# Altium schematic sheet Due_Breakout_Board supporting circuits.SchDoc: Due Breakout Board Supporting Circuits
size A; Author: A. Jefferson; Engineer: A. Jefferson; DocumentNumber: 3; Revision: A; SheetNumber: 3; SheetTotal: 3
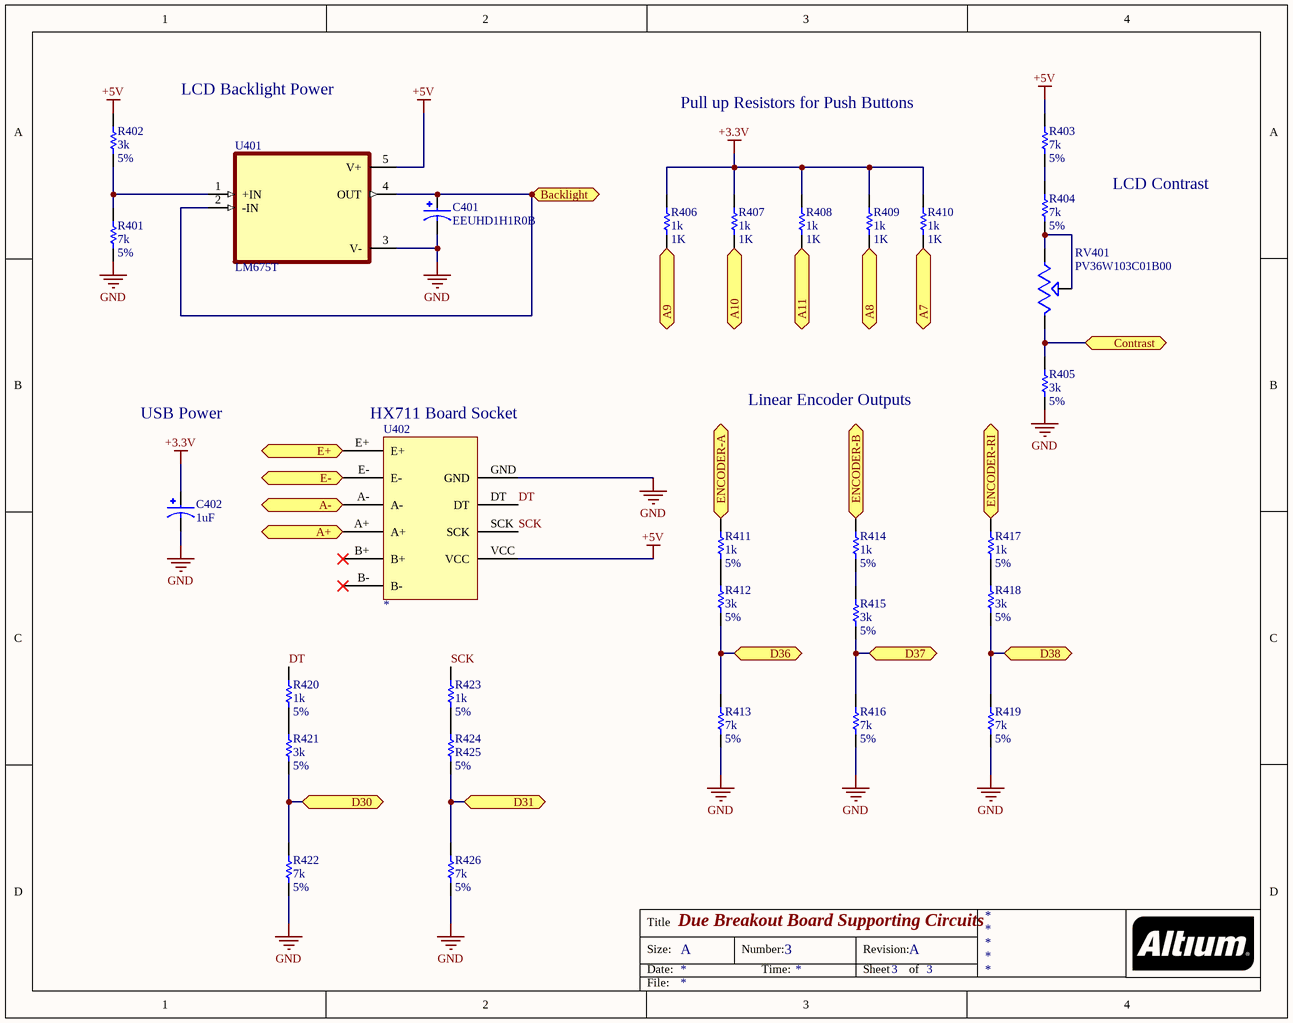
[diagram p0: Due_Breakout_Board supporting circuits.SchDoc]

## Parts
C401  EEUHD1H1R0B  [CAPPRD500W50D500H1100]
C402  1uF  [CAPPRD500W50D500H1100]
R401  7k  value 5%  [AXIAL-0.3]
R402  3k  value 5%  [AXIAL-0.3]
R403  7k  value 5%  [AXIAL-0.3]
R404  7k  value 5%  [AXIAL-0.3]
R405  3k  value 5%  [AXIAL-0.3]
R406  1k  [AXIAL-0.3]
R407  1k  [AXIAL-0.3]
R408  1k  [AXIAL-0.3]
R409  1k  [AXIAL-0.3]
R410  1k  [AXIAL-0.3]
R411  1k  value 5%  [AXIAL-0.3]
R412  3k  value 5%  [AXIAL-0.3]
R413  7k  value 5%  [AXIAL-0.3]
R414  1k  value 5%  [AXIAL-0.3]
R415  3k  value 5%  [AXIAL-0.3]
R416  7k  value 5%  [AXIAL-0.3]
R417  1k  value 5%  [AXIAL-0.3]
R418  3k  value 5%  [AXIAL-0.3]
R419  7k  value 5%  [AXIAL-0.3]
R420  1k  value 5%  [AXIAL-0.3]
R421  3k  value 5%  [AXIAL-0.3]
R422  7k  value 5%  [AXIAL-0.3]
R423  1k  value 5%  [AXIAL-0.3]
R424  R425  value 5%  [AXIAL-0.3]
R426  7k  value 5%  [AXIAL-0.3]
RV401  PV36W103C01B00  [TRIM_PV36W103C01B00]
U401  LM675T  [TO170P1016X470X2092-5]
U402  *  [HX711_MOD]

## Ports
A7, A8, A9, A10, A11, A+, A-, Backlight, Contrast, D30, D31, D36, D37, D38, E+, E-, ENCODER-A, ENCODER-B, ENCODER-RI

## Nets
+3.3V: C402.P R406.2 R407.2 R408.2 R409.1 R410.1
+5V: R402.2 R403.2 U401.5(V+) U402.VCC
GND: C401.N C402.N R401.1 R405.1 R413.1 R416.1 R419.1 R422.1 R426.1 U401.3(V-) U402.GND
A7: R410.2 ; port A7
A8: R409.2 ; port A8
A9: R406.1 ; port A9
A10: R407.1 ; port A10
A11: R408.1 ; port A11
A+: U402.A+ ; port A+
A-: U402.A- ; port A-
Backlight: C401.P U401.2(-IN) U401.4(OUT) ; port Backlight
Contrast: R405.2 RV401.3 ; port Contrast
D30: R421.1 R422.2 ; port D30
D31: R424.1 R426.2 ; port D31
D36: R412.1 R413.2 ; port D36
D37: R415.1 R416.2 ; port D37
D38: R418.1 R419.2 ; port D38
DT: R420.2 U402.DT
E+: U402.E+ ; port E+
E-: U402.E- ; port E-
ENCODER-A: R411.2 ; port ENCODER-A
ENCODER-B: R414.2 ; port ENCODER-B
ENCODER-RI: R417.2 ; port ENCODER-RI
SCK: R423.2 U402.SCK
NetR401_2: R401.2 R402.1 U401.1(+IN)
NetR403_1: R403.1 R404.2
NetR404_1: R404.1 RV401.1 RV401.2
NetR411_1: R411.1 R412.2
NetR414_1: R414.1 R415.2
NetR417_1: R417.1 R418.2
NetR420_1: R420.1 R421.2
NetR423_1: R423.1 R424.2

Not connected (* = marked no-connect by the designer): U402 B+* B-*

## Notes on the sheet
- LCD Backlight Power
- Pull up Resistors for Push Buttons
- LCD Contrast
- USB Power
- (near U402) HX711 Board Socket
- Linear Encoder Outputs
- Title
- Size:
- Date:
- A
- Number:
- Time:
- Revision:
- Sheet
- of
- File:

## Library data of the parts
C401 C402 = EEUHD1H1R0B: Cap Aluminum Lytic 1uF 50V 20% (5 X 11mm) Radial 5mm 10mA 1000h 105Â°C Automotive Ammo; MF: Panasonic; Package: RADIAL-2 Panasonic; Price: None; Check_prices: https://www.snapeda.com/parts/EEUHD1H1R0B/Panasonic/view-part/5786221/?ref=eda; Value: *; MP: EEUHD1H1R0B; SnapEDA_Link: https://www.snapeda.com/parts/EEUHD1H1R0B/Panasonic/view-part/5786221/?ref=snap; Availability: In Stock
R401-R424 R426 = Res1: Resistor; Published: 8-Jun-2000; LatestRevisionDate: 17-Jul-2002; LatestRevisionNote: Re-released for DXP Platform.; PackageReference: AXIAL-0.3; Publisher: Altium Limited; PackageDescription: Axial Device, Thru-Hole; 2 Leads; 0.3 in Pin Spacing
  R406-R410: Value: 1K
RV401 = PV36W103C01B00: 10 kOhms 0.5W, 1/2W PC Pins Through Hole Trimmer Potentiometer Cermet 25 Turn Top Adjustment; MF: Bourns; Availability: Unavailable; MP: PV36W103C01B00; Price: None; Value: *; SnapEDA_Link: https://www.snapeda.com/parts/PV36W103C01B00/Bourns/view-part/1439094/?ref=snap; Package: 6332 Bourns
U401 = LM675T: Power Operational Amplifier 5-TO-220 0 to 70; MF: Texas Instruments; Availability: Good; Check_prices: https://www.snapeda.com/parts/LM675T/Texas%20Instruments/view-part/559237/?ref=eda; Value: *; Package: TO-220-5 Texas Instruments; MP: LM675T; Price: None; SnapEDA_Link: https://www.snapeda.com/parts/LM675T/Texas%20Instruments/view-part/559237/?ref=snap; Purchase-URL: https://pricing.snapeda.com/search/part/LM675T/?ref=eda
U402 = HX711_MOD